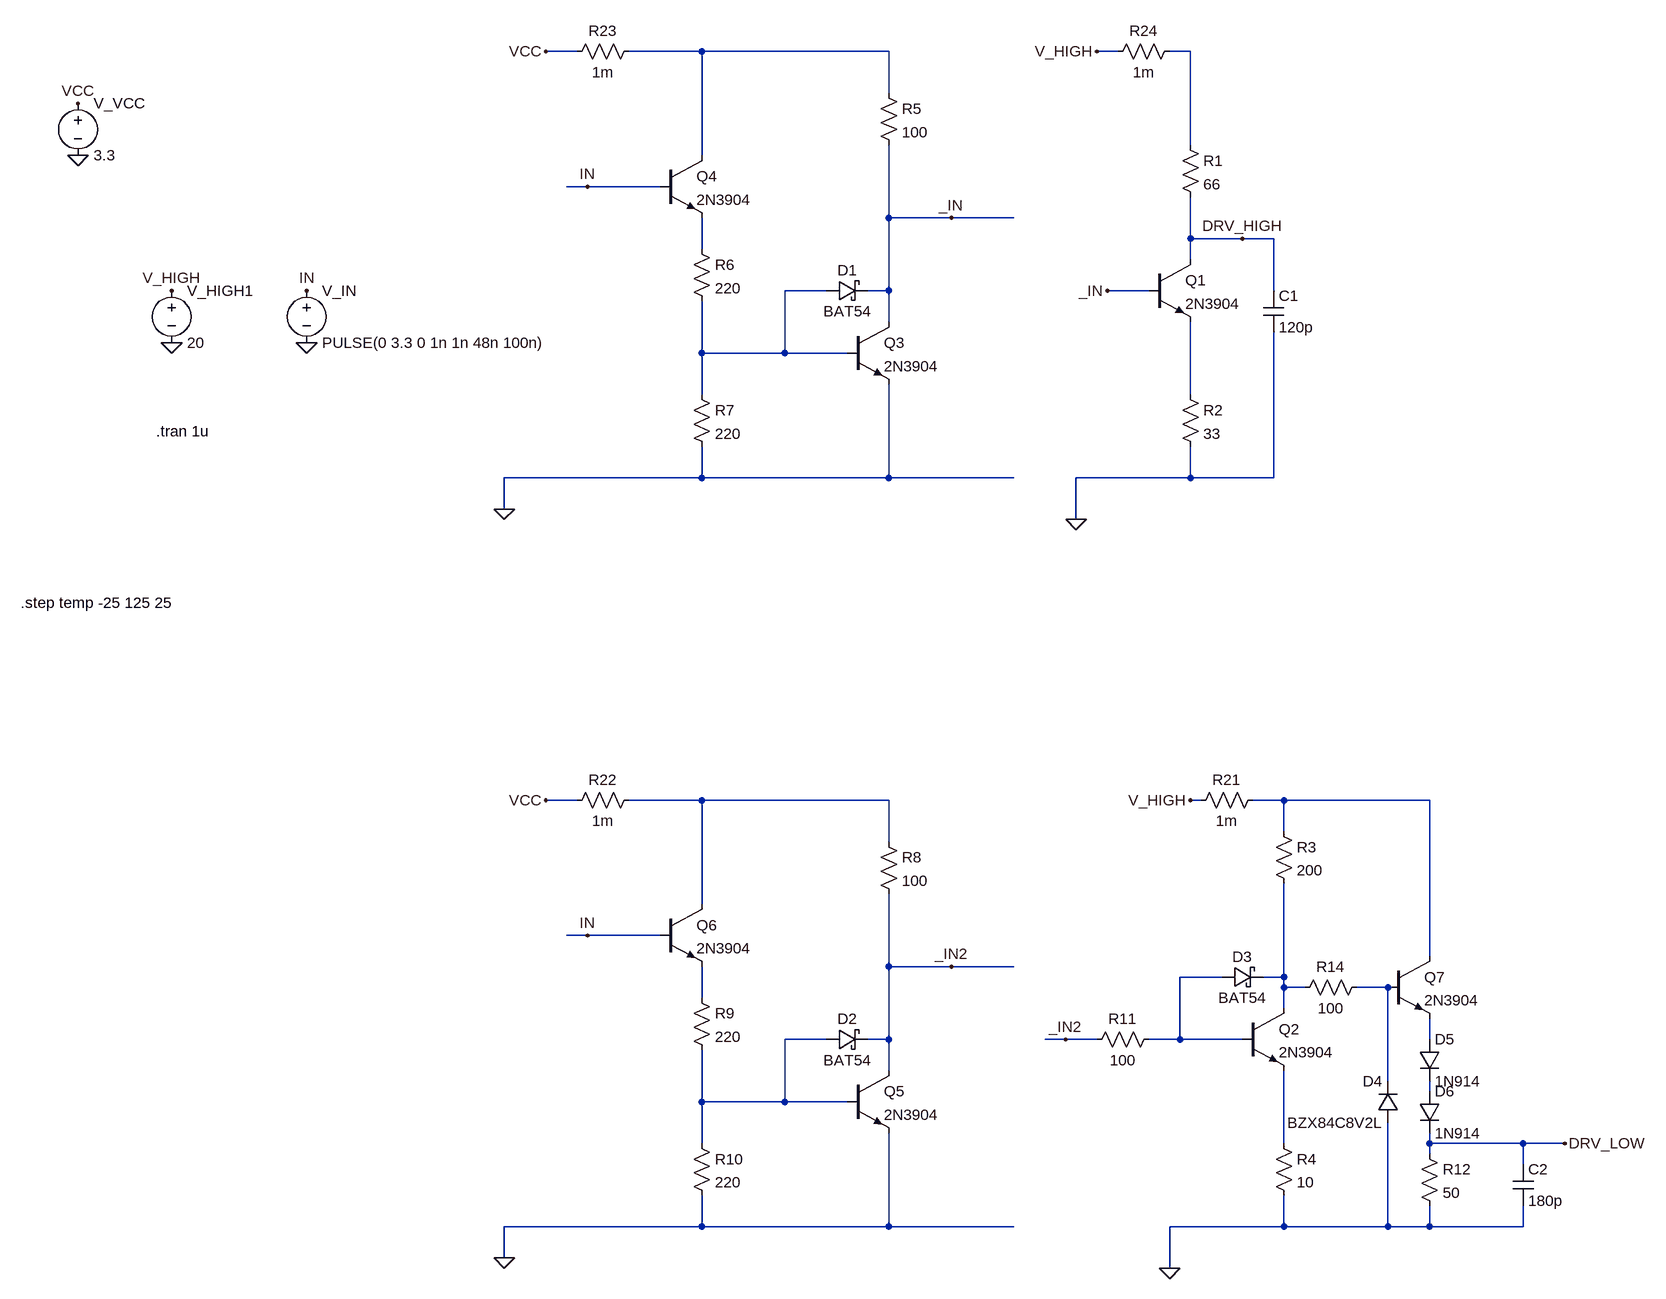
[diagram p0: schematic line_switch_driver_new.asc]
line_switch_driver_new.asc, the LTspice schematic file:
Version 4.1
SHEET 1 880 2612
WIRE -1216 -208 -1264 -208
WIRE -1024 -208 -1136 -208
WIRE -736 -208 -1024 -208
WIRE -384 -208 -416 -208
WIRE -272 -208 -304 -208
WIRE -736 -144 -736 -208
WIRE -272 -64 -272 -208
WIRE -1024 -48 -1024 -208
WIRE -1200 0 -1232 0
WIRE -1088 0 -1200 0
WIRE -736 48 -736 -64
WIRE -640 48 -736 48
WIRE -544 48 -640 48
WIRE -272 80 -272 16
WIRE -192 80 -272 80
WIRE -144 80 -192 80
WIRE -1024 96 -1024 48
WIRE -272 112 -272 80
WIRE -832 160 -896 160
WIRE -736 160 -736 48
WIRE -736 160 -768 160
WIRE -336 160 -400 160
WIRE -144 160 -144 80
WIRE -736 208 -736 160
WIRE -1024 256 -1024 176
WIRE -896 256 -896 160
WIRE -896 256 -1024 256
WIRE -800 256 -896 256
WIRE -1024 320 -1024 256
WIRE -272 320 -272 208
WIRE -1024 448 -1024 400
WIRE -1024 448 -1328 448
WIRE -736 448 -736 304
WIRE -736 448 -1024 448
WIRE -544 448 -736 448
WIRE -272 448 -272 400
WIRE -272 448 -448 448
WIRE -144 448 -144 224
WIRE -144 448 -272 448
WIRE -1328 496 -1328 448
WIRE -448 512 -448 448
WIRE -1216 944 -1264 944
WIRE -1024 944 -1136 944
WIRE -736 944 -1024 944
WIRE -256 944 -272 944
WIRE -128 944 -176 944
WIRE 96 944 -128 944
WIRE -128 992 -128 944
WIRE -736 1008 -736 944
WIRE -1024 1104 -1024 944
WIRE -1200 1152 -1232 1152
WIRE -1088 1152 -1200 1152
WIRE 96 1184 96 944
WIRE -736 1200 -736 1088
WIRE -640 1200 -736 1200
WIRE -544 1200 -640 1200
WIRE -224 1216 -288 1216
WIRE -128 1216 -128 1072
WIRE -128 1216 -160 1216
WIRE -128 1232 -128 1216
WIRE -96 1232 -128 1232
WIRE 32 1232 -16 1232
WIRE -1024 1248 -1024 1200
WIRE -128 1264 -128 1232
WIRE -832 1312 -896 1312
WIRE -736 1312 -736 1200
WIRE -736 1312 -768 1312
WIRE -464 1312 -496 1312
WIRE -416 1312 -464 1312
WIRE -288 1312 -288 1216
WIRE -288 1312 -336 1312
WIRE -192 1312 -288 1312
WIRE 96 1312 96 1280
WIRE -736 1360 -736 1312
WIRE 32 1376 32 1232
WIRE 96 1392 96 1376
WIRE -1024 1408 -1024 1328
WIRE -896 1408 -896 1312
WIRE -896 1408 -1024 1408
WIRE -800 1408 -896 1408
WIRE -1024 1472 -1024 1408
WIRE -128 1472 -128 1360
WIRE 96 1472 96 1456
WIRE 240 1472 96 1472
WIRE 304 1472 240 1472
WIRE 96 1488 96 1472
WIRE 240 1504 240 1472
WIRE -1024 1600 -1024 1552
WIRE -1024 1600 -1328 1600
WIRE -736 1600 -736 1456
WIRE -736 1600 -1024 1600
WIRE -544 1600 -736 1600
WIRE -128 1600 -128 1552
WIRE -128 1600 -304 1600
WIRE 32 1600 32 1440
WIRE 32 1600 -128 1600
WIRE 96 1600 96 1568
WIRE 96 1600 32 1600
WIRE 240 1600 240 1568
WIRE 240 1600 96 1600
WIRE -1328 1648 -1328 1600
WIRE -304 1664 -304 1600
FLAG -416 -208 V_HIGH
FLAG -1632 160 IN
FLAG -448 512 0
FLAG -1328 496 0
FLAG -640 48 _IN
FLAG -1200 0 IN
FLAG -1264 -208 VCC
FLAG -1632 240 0
FLAG -400 160 _IN
FLAG -1984 -128 VCC
FLAG -1984 -48 0
FLAG -1328 1648 0
FLAG -640 1200 _IN2
FLAG -1200 1152 IN
FLAG -1264 944 VCC
FLAG -1840 160 V_HIGH
FLAG -1840 240 0
FLAG -272 944 V_HIGH
FLAG -304 1664 0
FLAG -464 1312 _IN2
FLAG 304 1472 DRV_LOW
FLAG -192 80 DRV_HIGH
SYMBOL npn -336 112 R0
SYMATTR InstName Q1
SYMATTR Value 2N3904
SYMBOL res -288 -80 R0
SYMATTR InstName R1
SYMATTR Value 66
SYMBOL res -288 304 R0
SYMATTR InstName R2
SYMATTR Value 33
SYMBOL voltage -1632 144 R0
WINDOW 123 0 0 Left 0
WINDOW 39 0 0 Left 0
SYMATTR InstName V_IN
SYMATTR Value PULSE(0 3.3 0 1n 1n 48n 100n)
SYMBOL cap -160 160 R0
SYMATTR InstName C1
SYMATTR Value 120p
SYMBOL npn -800 208 R0
SYMATTR InstName Q3
SYMATTR Value 2N3904
SYMBOL schottky -832 176 R270
WINDOW 0 32 32 VTop 2
WINDOW 3 0 32 VBottom 2
SYMATTR InstName D1
SYMATTR Value BAT54
SYMATTR Description Diode
SYMATTR Type diode
SYMBOL npn -1088 -48 R0
SYMATTR InstName Q4
SYMATTR Value 2N3904
SYMBOL res -752 -160 R0
SYMATTR InstName R5
SYMATTR Value 100
SYMBOL res -1040 80 R0
SYMATTR InstName R6
SYMATTR Value 220
SYMBOL res -1040 304 R0
SYMATTR InstName R7
SYMATTR Value 220
SYMBOL voltage -1984 -144 R0
SYMATTR InstName V_VCC
SYMATTR Value 3.3
SYMBOL npn -800 1360 R0
SYMATTR InstName Q5
SYMATTR Value 2N3904
SYMBOL schottky -832 1328 R270
WINDOW 0 32 32 VTop 2
WINDOW 3 0 32 VBottom 2
SYMATTR InstName D2
SYMATTR Value BAT54
SYMATTR Description Diode
SYMATTR Type diode
SYMBOL npn -1088 1104 R0
SYMATTR InstName Q6
SYMATTR Value 2N3904
SYMBOL res -752 992 R0
SYMATTR InstName R8
SYMATTR Value 100
SYMBOL res -1040 1232 R0
SYMATTR InstName R9
SYMATTR Value 220
SYMBOL res -1040 1456 R0
SYMATTR InstName R10
SYMATTR Value 220
SYMBOL voltage -1840 144 R0
SYMATTR InstName V_HIGH1
SYMATTR Value 20
SYMBOL res -144 976 R0
SYMATTR InstName R3
SYMATTR Value 200
SYMBOL res -144 1456 R0
SYMATTR InstName R4
SYMATTR Value 10
SYMBOL cap 224 1504 R0
SYMATTR InstName C2
SYMATTR Value 180p
SYMBOL res -320 1296 R90
WINDOW 0 0 56 VBottom 2
WINDOW 3 32 56 VTop 2
SYMATTR InstName R11
SYMATTR Value 100
SYMBOL npn -192 1264 R0
SYMATTR InstName Q2
SYMATTR Value 2N3904
SYMBOL schottky -224 1232 R270
WINDOW 0 32 32 VTop 2
WINDOW 3 0 32 VBottom 2
SYMATTR InstName D3
SYMATTR Value BAT54
SYMATTR Description Diode
SYMATTR Type diode
SYMBOL diode 48 1440 R180
WINDOW 0 24 64 Left 2
WINDOW 3 24 0 Left 2
SYMATTR InstName D4
SYMATTR Value BZX84C8V2L
SYMBOL res 80 1472 R0
SYMATTR InstName R12
SYMATTR Value 50
SYMBOL npn 32 1184 R0
SYMATTR InstName Q7
SYMATTR Value 2N3904
SYMBOL res 0 1216 R90
WINDOW 0 0 56 VBottom 2
WINDOW 3 32 56 VTop 2
SYMATTR InstName R14
SYMATTR Value 100
SYMBOL diode 80 1312 R0
SYMATTR InstName D5
SYMATTR Value 1N914
SYMBOL diode 80 1392 R0
SYMATTR InstName D6
SYMATTR Value 1N914
SYMBOL res -272 960 R270
WINDOW 0 32 56 VTop 2
WINDOW 3 0 56 VBottom 2
SYMATTR InstName R21
SYMATTR Value 1m
SYMBOL res -1232 960 R270
WINDOW 0 32 56 VTop 2
WINDOW 3 0 56 VBottom 2
SYMATTR InstName R22
SYMATTR Value 1m
SYMBOL res -1232 -192 R270
WINDOW 0 32 56 VTop 2
WINDOW 3 0 56 VBottom 2
SYMATTR InstName R23
SYMATTR Value 1m
SYMBOL res -400 -192 R270
WINDOW 0 32 56 VTop 2
WINDOW 3 0 56 VBottom 2
SYMATTR InstName R24
SYMATTR Value 1m
TEXT -1864 376 Left 2 !.tran 1u
TEXT -2072 640 Left 2 !.step temp -25 125 25

The netlist it stands for:
* line_switch_driver_new.asc
Q1 DRV_HIGH _IN N005 0 2N3904
R1 N002 DRV_HIGH 66
R2 N005 0 33
V_IN IN 0 PULSE(0 3.3 0 1n 1n 48n 100n)
C1 DRV_HIGH 0 120p
Q3 _IN N004 0 0 2N3904
D1 N004 _IN BAT54
Q4 N001 IN N003 0 2N3904
R5 N001 _IN 100
R6 N003 N004 220
R7 N004 0 220
V_VCC VCC 0 3.3
Q5 _IN2 N012 0 0 2N3904
D2 N012 _IN2 BAT54
Q6 N006 IN N011 0 2N3904
R8 N006 _IN2 100
R9 N011 N012 220
R10 N012 0 220
V_HIGH1 V_HIGH 0 20
R3 N007 N009 200
R4 N015 0 10
C2 DRV_LOW 0 180p
R11 N008 _IN2 100
Q2 N009 N008 N015 0 2N3904
D3 N008 N009 BAT54
D4 0 N010 BZX84C8V2L
R12 DRV_LOW 0 50
Q7 N007 N010 N013 0 2N3904
R14 N010 N009 100
D5 N013 N014 1N914
D6 N014 DRV_LOW 1N914
R21 V_HIGH N007 1m
R22 VCC N006 1m
R23 VCC N001 1m
R24 V_HIGH N002 1m
.model D D
.lib standard.dio
.model NPN NPN
.model PNP PNP
.lib standard.bjt
.tran 1u
.step temp -25 125 25
.backanno
.end